# EAGLE design usbmidilink (EAGLE 6.2)
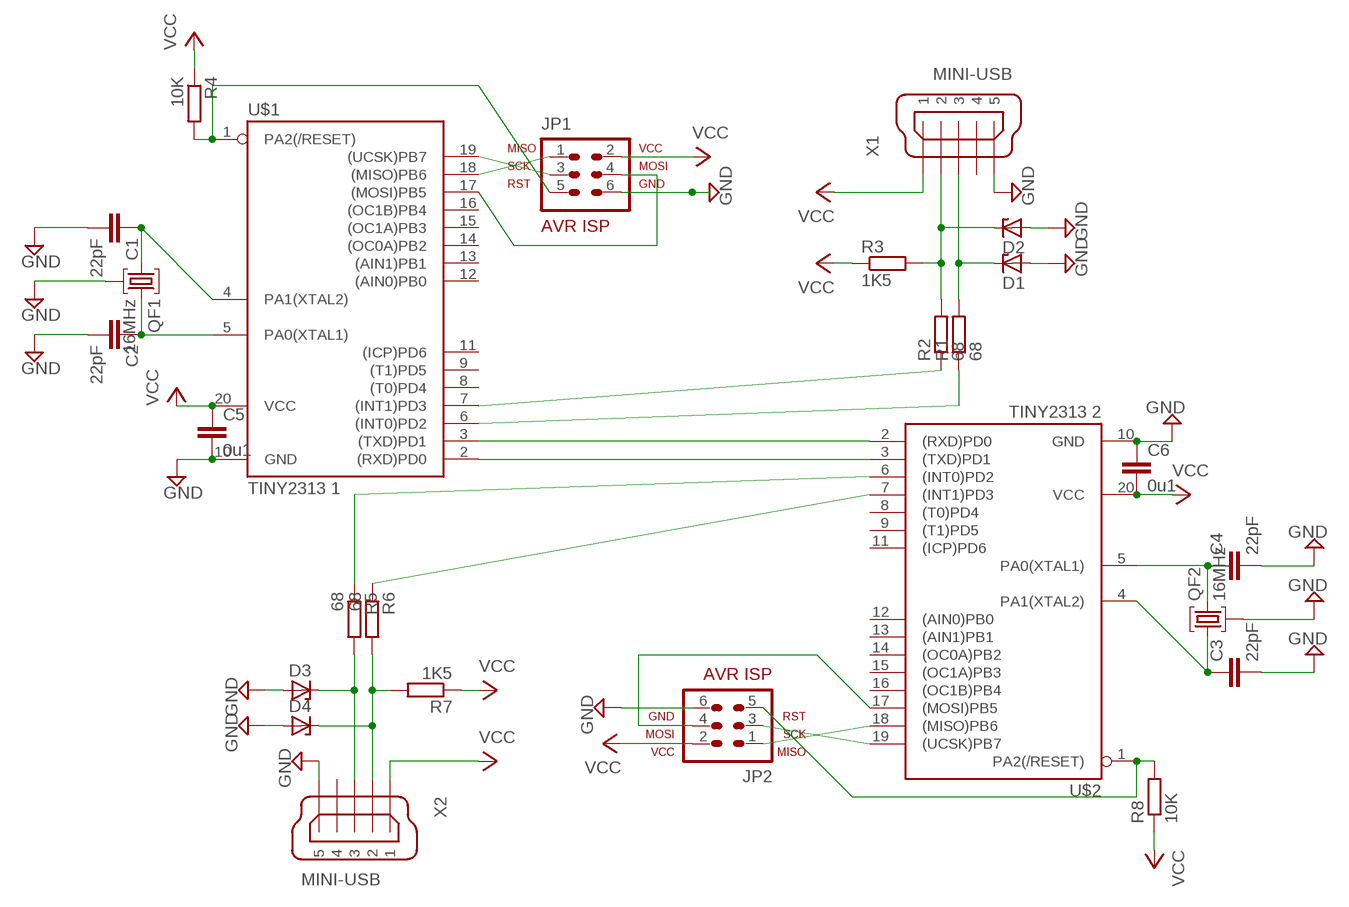
[diagram p0: schematic, sheet 1]

## Parts
C1  22pF  C2.5/4  [C2.5-4]
C2  22pF  C2.5/4  [C2.5-4]
C3  22pF  C2.5/4  [C2.5-4]
C4  22pF  C2.5/4  [C2.5-4]
C5  0u1  C2.5/4  [C2.5-4]
C6  0u1  C2.5/4  [C2.5-4]
D1  ZENER-DIODEZD-5  [ZDIO-5]
D2  ZENER-DIODEZD-5  [ZDIO-5]
D3  ZENER-DIODEZD-5  [ZDIO-5]
D4  ZENER-DIODEZD-5  [ZDIO-5]
JP1  AVR-ISP-6VERT  [AVR-ISP-6]
JP2  AVR-ISP-6VERT  [AVR-ISP-6]
QF1  16MHz  14M20BHC49T  [HC49U]
QF2  16MHz  14M20BHC49T  [HC49U]
R1  68  R-EU_0204/5  [0204/5]
R2  68  R-EU_0204/5  [0204/5]
R3  1K5  R-EU_0204/5  [0204/5]
R4  10K  R-EU_0204/5  [0204/5]
R5  68  R-EU_0204/5  [0204/5]
R6  68  R-EU_0204/5  [0204/5]
R7  1K5  R-EU_0204/5  [0204/5]
R8  10K  R-EU_0204/5  [0204/5]
U$1  TINY2313 1  TINY2313-*P*  [DIL20]
U$2  TINY2313 2  TINY2313-*P*  [DIL20]
X1  MINI-USB  MINI-USB-32005-201  [32005-201]
X2  MINI-USB  MINI-USB-32005-201  [32005-201]

## Nets
GND: C1.2 C2.2 C3.2 C4.2 C5.2 C6.1 D1.A D2.A D3.A D4.A JP1.6 JP2.6 QF1.2 QF2.2 U$1.10(GND) U$2.10(GND) X1.5 X2.5
N$1: R1.1 U$1.6((INT0)PD2)
N$2: R2.1 U$1.7((INT1)PD3)
N$3: C1.1 QF1.1 U$1.4(PA1(XTAL2))
N$4: C2.1 QF1.3 U$1.5(PA0(XTAL1))
N$5: D2.C R2.2 R3.2 X1.2
N$6: D1.C R1.2 X1.3
N$8: C3.1 QF2.1 U$2.4(PA1(XTAL2))
N$9: C4.1 QF2.3 U$2.5(PA0(XTAL1))
N$10: R6.1 U$2.7((INT1)PD3)
N$11: R5.1 U$2.6((INT0)PD2)
N$12: D4.C R6.2 R7.2 X2.2
N$13: D3.C R5.2 X2.3
N$15: U$1.2((RXD)PD0) U$2.3((TXD)PD1)
N$16: U$1.3((TXD)PD1) U$2.2((RXD)PD0)
N$17: JP2.1 U$2.18((MISO)PB6)
N$18: JP1.3 U$1.19((UCSK)PB7)
N$19: JP1.1 U$1.18((MISO)PB6)
N$20: JP1.5 R4.2 U$1.1(PA2(/RESET))
N$21: JP1.4 U$1.17((MOSI)PB5)
N$22: JP2.3 U$2.19((UCSK)PB7)
N$23: JP2.5 R8.2 U$2.1(PA2(/RESET))
N$24: JP2.4 U$2.17((MOSI)PB5)
VCC: C5.1 C6.2 JP1.2 JP2.2 R3.1 R4.1 R7.1 R8.1 U$1.20(VCC) U$2.20(VCC) X1.1 X2.1
Unconnected: U$1.8((T0)PD4) U$1.9((T1)PD5) U$1.11((ICP)PD6) U$1.12((AIN0)PB0) U$1.13((AIN1)PB1) U$1.14((OC0A)PB2) U$1.15((OC1A)PB3) U$1.16((OC1B)PB4) U$2.8((T0)PD4) U$2.9((T1)PD5) U$2.11((ICP)PD6) U$2.12((AIN0)PB0) U$2.13((AIN1)PB1) U$2.14((OC0A)PB2) U$2.15((OC1A)PB3) U$2.16((OC1B)PB4) X1.4 X2.4

## Library data of the parts
C1-C6 = capacitor-wima:C: CAPACITOR naming: grid - package width
D1-D4 = diode:ZENER-DIODE: Z-Diode
JP1 JP2 = avr-7:AVR-ISP-6: AVR ISP-6 Serial Programming Header
QF1 QF2 = crystal:14M20BHC49T: Monolithic Crystal Filters Source: www.vanlong.com; OC_FARNELL: unknown; OC_NEWARK: unknown
R1-R8 = rcl:R-EU_: RESISTOR, European symbol
U$1 U$2 = avr-7:TINY2313*: Atmel Tiny2313 2K Flash, 128 bytes EEPROM, 128 bytes RAM
X1 X2 = con-cypressindustries:MINI-USB-: MINI USB-B Conector Source: www.cypressindustries.com; OC_FARNELL: unknown; OC_NEWARK: unknown

## Board
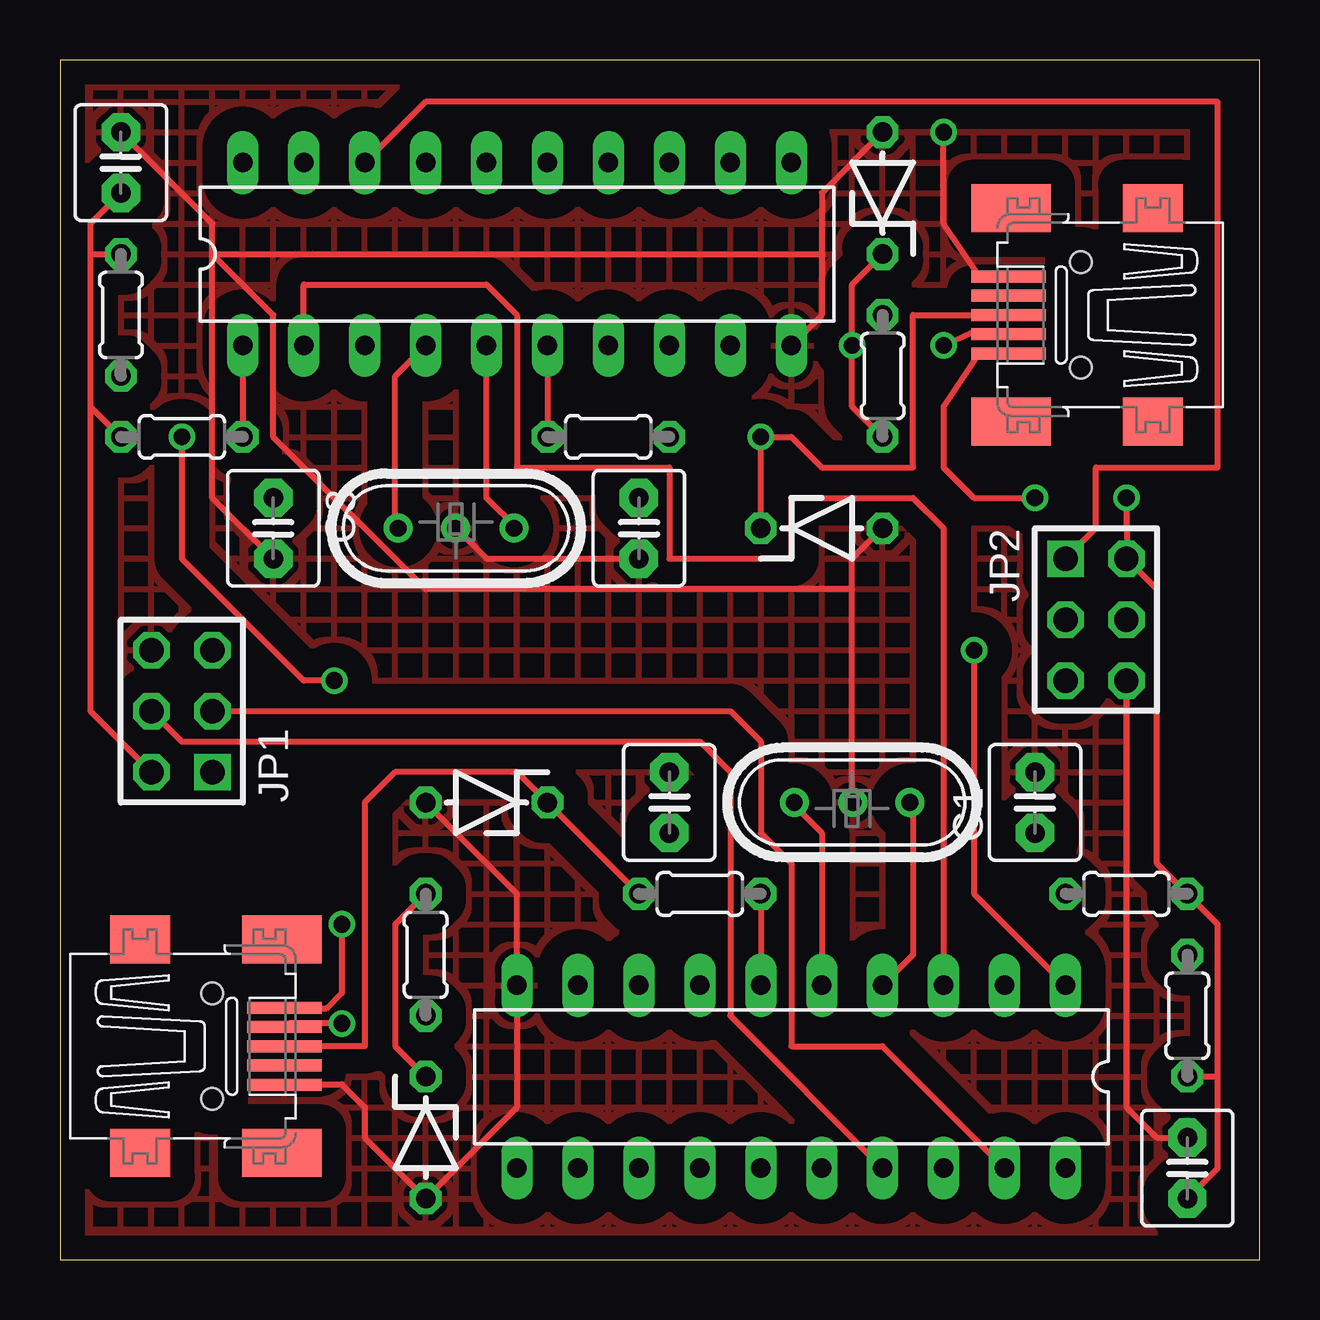
[diagram p1: board, top side]
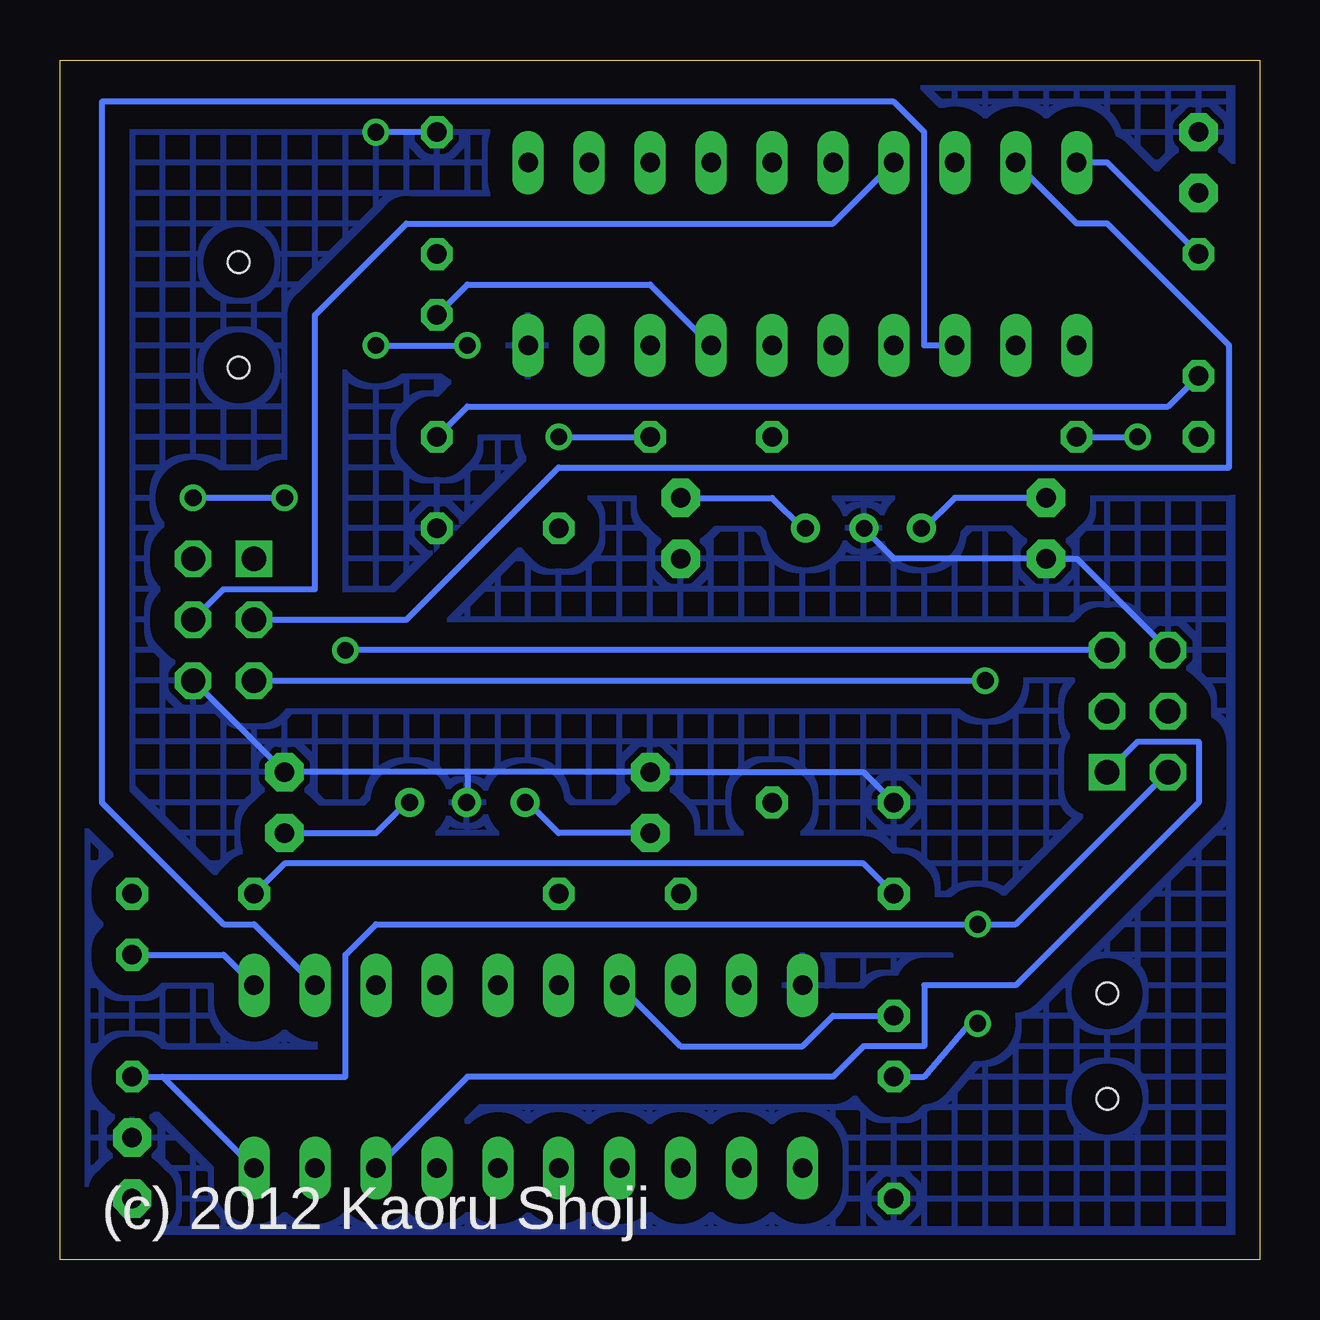
[diagram p2: board, bottom side, seen from below]

Size 50 x 50 mm. Coordinates in mm from the lower left corner, seen from the top.
Outline: 0,0 50,0 50,50 0,50 0,0
Copper layers (1*16): Top 0.035mm / dielectric 1.5mm / Bottom 0.035mm
Design rules: minimum track width 10mil, minimum drill 24mil, track to track 8mil, track to pad 8mil, pad to pad 8mil, via to via 8mil, smd to smd 8mil, copper to edge 40mil, drill to drill 8mil, minimum pad ring 10mil, minimum via ring 8mil, stop-mask expansion 4mil, vias tented up to drill 0mil, thermal gap 10mil

### Footprints (pad centres in the part's own frame; a part is rotated, then mirrored left to right if it is on the bottom)
C2.5-4 = drill 0.813 pad 1.6 octagon: 1 -1.27,0; 2 1.27,0
ZDIO-5 = drill 0.813 octagon: A 2.54,0; C -2.54,0
AVR-ISP-6 = drill 1.016 square: 1 -2.54,-1.27 | drill 1.016 octagon: 2 -2.54,1.27; 3 0,-1.27; 4 0,1.27; 5 2.54,-1.27; 6 2.54,1.27
HC49U = drill 0.7 pad 1.2: 1 -2.413,0; 2 -0.027,0; 3 2.413,0
0204/5 = drill 0.813 octagon: 1 -2.54,0; 2 2.54,0
DIL20 = drill 0.813 long: 1 -11.43,-3.81; 2 -8.89,-3.81; 3 -6.35,-3.81; 4 -3.81,-3.81; 5 -1.27,-3.81; 6 1.27,-3.81; 7 3.81,-3.81; 8 6.35,-3.81; 9 8.89,-3.81; 10 11.43,-3.81; 11 11.43,3.81; 12 8.89,3.81; 13 6.35,3.81; 14 3.81,3.81; 15 1.27,3.81; 16 -1.27,3.81; 17 -3.81,3.81; 18 -6.35,3.81; 19 -8.89,3.81; 20 -11.43,3.81
32005-201 = smd 3.1 x 0.5: 1 3,1.6; 2 3,0.8; 3 3,0; 4 3,-0.8; 5 3,-1.6 | smd 2.5 x 2: M1 -3,-4.45; M2 -3,4.45 | smd 3.3 x 2: M3 2.9,4.45; M4 2.9,-4.45 | hole 0.9: 0,2.2; 0,-2.2

### Placement (x,y rotation side)
C1  40.64,19.05 90 top
C2  25.4,19.05 90 top
C3  8.89,30.48 270 top
C4  24.13,30.48 270 top
C5  2.54,45.72 90 top
C6  46.99,3.81 270 top
D1  17.78,19.05 180 top
D2  15.24,5.08 270 top
D3  31.75,30.48 0 top
D4  34.29,44.45 90 top
JP1  5.08,22.86 90 top
JP2  43.18,26.67 270 top
QF1  33.02,19.05 180 top
QF2  16.51,30.48 0 top
R1  26.67,15.24 180 top
R2  15.24,12.7 90 top
R3  44.45,15.24 180 top
R4  46.99,10.16 90 top
R5  22.86,34.29 0 top
R6  34.29,36.83 270 top
R7  2.54,39.37 270 top
R8  5.08,34.29 0 top
U$1  30.48,7.62 180 top
U$2  19.05,41.91 0 top
X1  6.35,8.89 0 top
X2  42.55,39.37 180 top

### Tracks (layer width: path | path; a pad name or v marks a point on that pad's centre or on a via)
GND  (via drill 0.7)
  Top 0.254: U$2.10 31.75,39.37 31.75,41.91 | 31.75,41.91 31.75,44.45 D4.A | C5.2 6.35,43.18 6.35,41.91 | 6.35,41.91 6.35,31.75 C3.2 | C4.2 17.78,29.21 16.51,30.48 QF2.2 | 6.35,41.91 31.75,41.91 | JP2.6 44.45,6.35 45.72,5.08 C6.1 | D1.A 19.05,15.24 U$1.10 19.05,6.35 D2.A 12.7,5.08 12.7,6.35 11.75,7.3 9.53,7.3 X1.5 | 33.02,27.94 33.02,29.21 D3.A | 33.02,27.94 33.02,19.05 QF1.2 | 6.35,41.91 8.89,39.37 8.89,34.29 15.24,27.94 33.02,27.94 | 38.73,40.96 X2.5 38.73,41 38.33,41 36.83,43.18 v36.83,46.99
  Bottom 0.254: QF2.2 16.51,30.48 15.24,29.21 C3.2 7.62,29.21 JP1.6 | JP2.6 C1.2 33.02,20.32 | 33.02,20.32 33.02,19.05 QF1.2 | 33.02,20.32 C2.2 16.51,20.32 D1.A | D4.A v36.83,46.99
  pour Top (isolate 1.016, hatched): 0,50 50,50 50,0 0,0
  pour Bottom (isolate 1.016, hatched): 0,50 50,50 50,0 0,0
N$1
  Top 0.254: R1.1 U$1.6
N$2
  Bottom 0.254: R2.1 17.78,10.16 19.05,8.89 24.13,8.89 U$1.7
N$3
  Top 0.254: U$1.4 35.56,12.7 35.56,19.05 QF1.1
  Bottom 0.254: C1.1 36.83,17.78 35.56,19.05 QF1.1
N$4
  Top 0.254: U$1.5 31.75,17.78 30.48,19.05 QF1.3
  Bottom 0.254: C2.1 29.21,17.78 30.48,19.05 QF1.3
N$5  (via drill 0.7)
  Top 0.254: D2.C 13.97,8.89 13.97,13.97 R2.2 | v11.75,9.84 9.53,9.84 X1.2
  Bottom 0.254: R3.2 40.64,16.51 16.51,16.51 R2.2 | v11.75,9.84 12.06,9.84 13.97,7.62 D2.C
N$6
  Top 0.254: R1.2 D1.C 19.05,20.32 13.97,20.32 12.7,19.05 12.7,8.89 X1.3
N$8
  Top 0.254: U$2.4 13.97,36.83 13.97,30.48 QF2.1
  Bottom 0.254: C3.1 12.7,31.75 13.97,30.48 QF2.1
N$9
  Top 0.254: U$2.5 17.78,31.75 19.05,30.48 QF2.3
  Bottom 0.254: C4.1 20.32,31.75 19.05,30.48 QF2.3
N$10
  Bottom 0.254: U$2.7 25.4,40.64 33.02,40.64 R6.1
N$11
  Top 0.254: U$2.6 R5.1
N$12  (via drill 0.7)
  Top 0.254: D4.C 33.02,40.64 v33.02,38.1 33.02,35.56 R6.2 | v36.83,38.1 37.93,38.6 39.53,38.6 X2.2
  Bottom 0.254: R7.2 3.81,35.56 33.02,35.56 R6.2 | v36.83,38.1 v33.02,38.1
N$13  (via drill 0.7)
  Top 0.254: D3.C v29.21,34.29 30.48,34.29 31.75,33.02 35.56,33.02 35.56,39.37 X2.3
  Bottom 0.254: v29.21,34.29 R5.2
N$15
  Bottom 0.254: U$1.2 41.91,13.97 43.18,13.97 48.26,19.05 48.26,48.26 15.24,48.26 13.97,46.99 13.97,38.1 U$2.3
N$16
  Top 0.254: U$1.3 36.83,30.48 35.56,31.75 30.48,31.75 30.48,29.21 25.4,29.21 25.4,33.02 19.05,33.02 19.05,39.37 17.78,40.64 10.16,40.64 U$2.2
N$17
  Top 0.254: U$2.18 15.24,48.26 48.26,48.26 48.26,33.02 43.18,33.02 43.18,30.48 JP2.1
N$18
  Top 0.254: U$1.19 34.29,8.89 30.48,8.89 30.48,16.51 29.21,17.78 29.21,21.59 27.94,22.86 JP1.3
N$19
  Bottom 0.254: U$1.18 33.02,7.62 17.78,7.62 16.51,8.89 13.97,8.89 13.97,11.43 10.16,11.43 2.54,19.05 2.54,21.59 5.08,21.59 JP1.1
N$20  (via drill 0.7 pad 0.41)
  Top 0.254: U$1.1 38.1,15.24 v38.1,25.4
  Bottom 0.254: U$1.1 43.18,12.7 R4.2 | JP1.5 v38.1,25.4
N$21
  Top 0.254: U$1.17 27.94,10.16 27.94,20.32 26.67,21.59 5.08,21.59 JP1.4
N$22
  Bottom 0.254: JP2.3 35.56,26.67 29.21,33.02 1.27,33.02 1.27,38.1 6.35,43.18 7.62,43.18 U$2.19
N$23  (via drill 0.7 pad 0.41)
  Top 0.254: U$2.1 R8.2 | v5.08,34.29 5.08,29.21 10.16,24.13 v11.43,24.13
  Bottom 0.254: R8.2 v5.08,34.29 | JP2.5 v11.43,24.13
N$24
  Bottom 0.254: U$2.17 17.78,43.18 35.56,43.18 39.37,39.37 39.37,27.94 43.18,27.94 JP2.4
VCC  (via drill 0.7)
  Top 0.254: 1.27,35.56 R8.1 | C5.1 1.27,43.18 1.27,41.91 | 1.27,41.91 1.27,35.56 | 1.27,41.91 R7.1 | JP1.2 1.27,22.86 1.27,35.56 | C6.2 48.26,3.81 48.26,7.62 | 48.26,7.62 48.26,13.97 R3.1 45.72,16.51 45.72,27.94 JP2.2 44.53,29.27 44.45,30.48 v44.45,31.75 | 48.26,7.62 R4.1 | X1.1 9.53,10.48 11.11,10.48 11.75,11.11 v11.75,13.97 | v40.64,31.75 38.1,31.75 36.83,33.02 36.83,35.56 38.33,37.8 39.53,37.8 X2.1
  Bottom 0.254: U$2.20 6.35,45.72 R7.1 | 45.72,7.62 U$1.20 | R4.1 45.72,7.62 | JP1.2 10.16,13.97 v11.75,13.97 36.83,13.97 38.1,12.7 38.1,7.62 45.72,7.62 | v40.64,31.75 v44.45,31.75

### Text on the board
tNames: Order No. 60630
bNames: (c) 2012 Kaoru Shoji